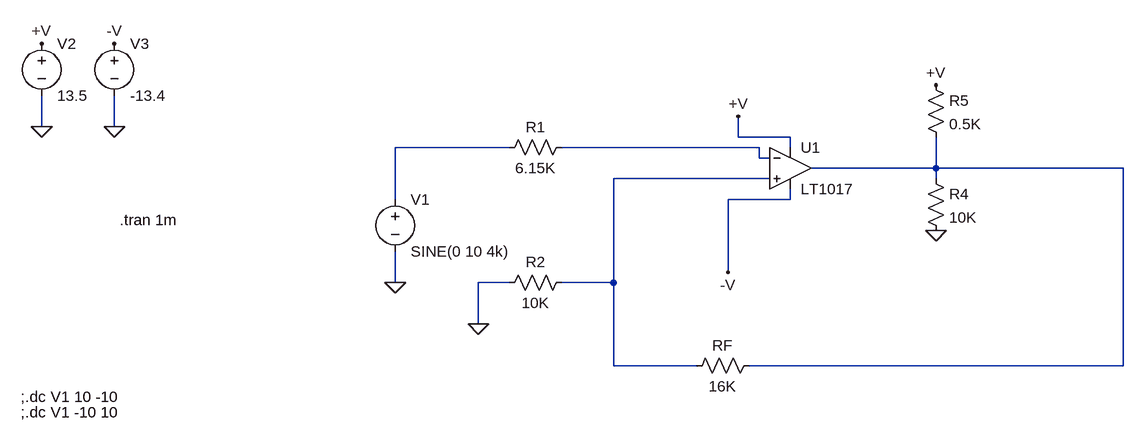
[diagram p0: schematic EJERCICO1a.asc]
EJERCICO1a.asc, the LTspice schematic file:
Version 4
SHEET 1 880 680
WIRE -832 112 -832 64
WIRE -720 112 -720 64
WIRE 240 128 240 96
WIRE 320 128 240 128
WIRE -112 144 -288 144
WIRE 272 144 -32 144
WIRE 320 144 320 128
WIRE 272 160 272 144
WIRE 288 160 272 160
WIRE 544 176 544 128
WIRE 544 176 352 176
WIRE 832 176 544 176
WIRE 288 192 48 192
WIRE 544 192 544 176
WIRE -288 224 -288 144
WIRE 320 224 320 208
WIRE 320 224 224 224
WIRE 224 336 224 224
WIRE -288 352 -288 304
WIRE -112 352 -160 352
WIRE 48 352 48 192
WIRE 48 352 -32 352
WIRE -160 416 -160 352
WIRE 48 480 48 352
WIRE 176 480 48 480
WIRE 832 480 832 176
WIRE 832 480 256 480
FLAG -288 352 0
FLAG -160 416 0
FLAG -832 112 0
FLAG -720 112 0
FLAG -832 -16 +V
FLAG 240 96 +V
FLAG -720 -16 -V
FLAG 224 336 -V
FLAG 544 272 0
FLAG 544 48 +V
SYMBOL res -16 128 R90
WINDOW 0 0 56 VBottom 2
WINDOW 3 32 56 VTop 2
SYMATTR InstName R1
SYMATTR Value 6.15K
SYMBOL res -16 336 R90
WINDOW 0 0 56 VBottom 2
WINDOW 3 32 56 VTop 2
SYMATTR InstName R2
SYMATTR Value 10K
SYMBOL res 272 464 R90
WINDOW 0 0 56 VBottom 2
WINDOW 3 32 56 VTop 2
SYMATTR InstName RF
SYMATTR Value 16K
SYMBOL voltage -288 208 R0
WINDOW 123 0 0 Left 2
WINDOW 39 0 0 Left 2
SYMATTR InstName V1
SYMATTR Value SINE(0 10 4k)
SYMBOL voltage -832 -32 R0
WINDOW 123 0 0 Left 2
WINDOW 39 0 0 Left 2
SYMATTR InstName V2
SYMATTR Value 13.5
SYMBOL voltage -720 -32 R0
WINDOW 123 0 0 Left 2
WINDOW 39 0 0 Left 2
SYMATTR InstName V3
SYMATTR Value -13.4
SYMBOL res 528 176 R0
SYMATTR InstName R4
SYMATTR Value 10K
SYMBOL res 528 32 R0
SYMATTR InstName R5
SYMATTR Value 0.5K
SYMBOL LT1017 320 176 R0
SYMATTR InstName U1
TEXT -864 528 Left 2 !;.dc V1 10 -10
TEXT -864 552 Left 2 !;.dc V1 -10 10
TEXT -712 256 Left 2 !.tran 1m

The netlist it stands for:
* EJERCICO1a.asc
R1 N002 N001 6.15K
R2 N004 0 10K
RF N003 N004 16K
V1 N001 0 SINE(0 10 4k)
V2 +V 0 13.5
V3 -V 0 -13.4
R4 N003 0 10K
R5 +V N003 0.5K
XU1 N004 N002 +V -V N003 LT1017  ; pins In+ In- V+ V- OUT
;.dc V1 10 -10
;.dc V1 -10 10
.tran 1m
.backanno
.end